# EAGLE schematic IoT Garden Electronics Design v2 (EAGLE 9.7.0)
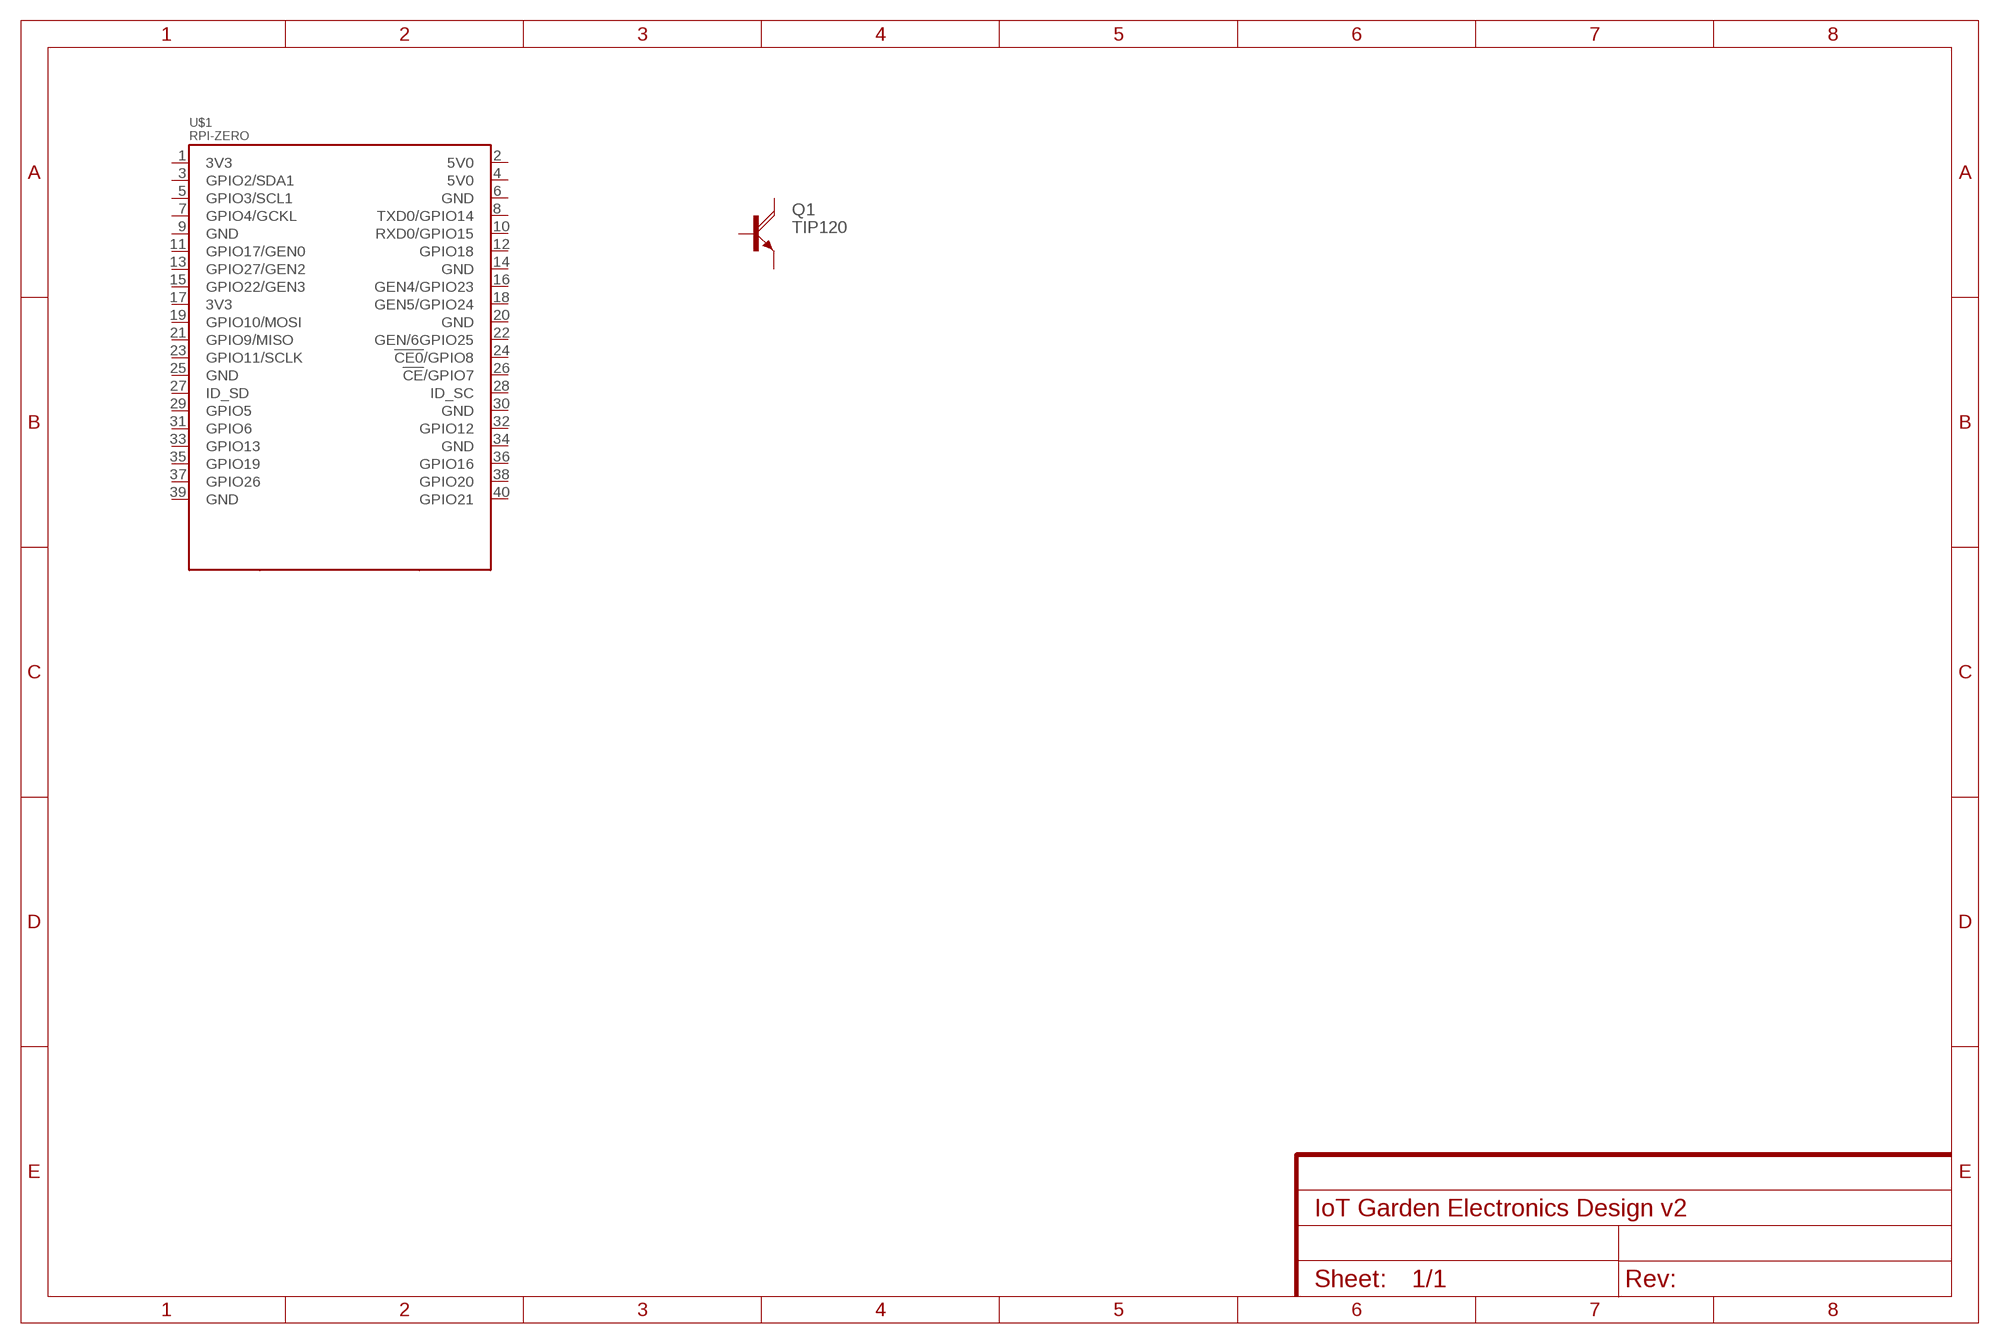
[diagram p0: schematic, sheet 1]

## Parts
Q1  TIP120  [TO220AH]
U$1  RPI-ZERO  [RASPBERRYPI_BASTELSTUBE_V13_RASPI_BOARD_B+_FULL]
Unconnected: Q1.B Q1.C Q1.E U$1.1(3V3) U$1.2(5V0) U$1.3(GPIO2/SDA1) U$1.4(5V0) U$1.5(GPIO3/SCL1) U$1.6(GND) U$1.7(GPIO4/GCKL) U$1.8(TXD0/GPIO14) U$1.9(GND) U$1.10(RXD0/GPIO15) U$1.11(GPIO17/GEN0) U$1.12(GPIO18) U$1.13(GPIO27/GEN2) U$1.14(GND) U$1.15(GPIO22/GEN3) U$1.16(GEN4/GPIO23) U$1.17(3V3) U$1.18(GEN5/GPIO24) U$1.19(GPIO10/MOSI) U$1.20(GND) U$1.21(GPIO9/MISO) U$1.22(GEN/6GPIO25) U$1.23(GPIO11/SCLK) U$1.24(!CE0!/GPIO8) U$1.25(GND) U$1.26(!CE!/GPIO7) U$1.27(ID_SD) U$1.28(ID_SC) U$1.29(GPIO5) U$1.30(GND) U$1.31(GPIO6) U$1.32(GPIO12) U$1.33(GPIO13) U$1.34(GND) U$1.35(GPIO19) U$1.36(GPIO16) U$1.37(GPIO26) U$1.38(GPIO20) U$1.39(GND) U$1.40(GPIO21)

## Library data of the parts
Q1 = TIP120:TIP120: NPN DARLINGTON TRANSISTOR Check prices <https://pricing.snapeda.com/parts/TIP120/ON/view-part?ref=eda>; AVAILABILITY: In Stock; DESCRIPTION: Bipolar (BJT) Transistor NPN - Darlington 60V 5A 2W Through Hole TO-220-3; MF: ON; MP: TIP120; PACKAGE: TO-220 Texas Instruments; PRICE: None; PURCHASE-URL: https://pricing.snapeda.com/search/part/TIP120/?ref=eda
U$1 = RPI-Zero:RPI-ZERO